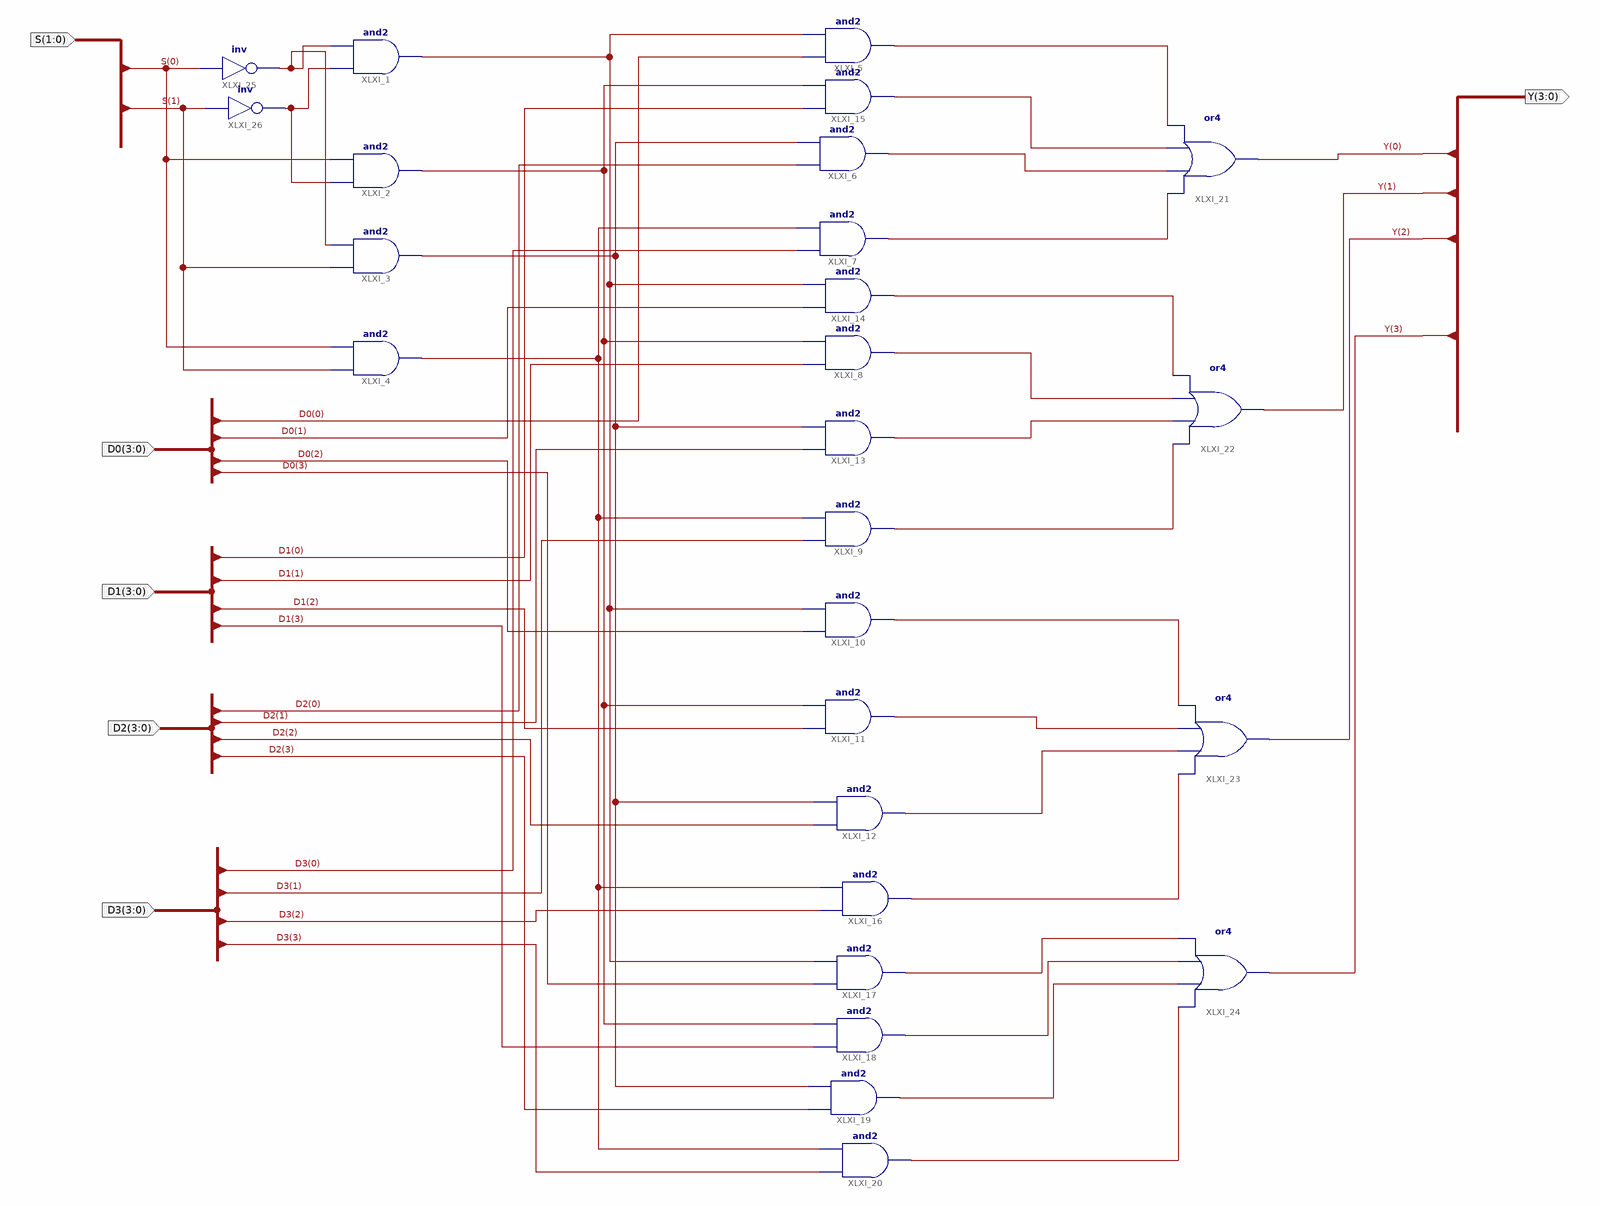
[diagram p0: schematic sheet 1]
// Xilinx ISE schematic Mux4to1b4.sch (kintex7) as structural Verilog: 26 symbols, 6 ports
module Mux4to1b4 (
  input  [1:0] S,
  input  [3:0] D0,
  input  [3:0] D1,
  input  [3:0] D2,
  input  [3:0] D3,
  output [3:0] Y
);

  wire XLXN_6, XLXN_14, XLXN_24, XLXN_32, XLXN_36, XLXN_40, XLXN_63, XLXN_64, XLXN_65, XLXN_66, XLXN_67,
       XLXN_68, XLXN_69, XLXN_70, XLXN_71, XLXN_72, XLXN_73, XLXN_74, XLXN_75, XLXN_76, XLXN_77, XLXN_78;

  and XLXI_1 (XLXN_24, XLXN_14, XLXN_6);
  and XLXI_2 (XLXN_32, XLXN_14, S[0]);
  and XLXI_3 (XLXN_36, S[1], XLXN_6);
  and XLXI_4 (XLXN_40, S[1], S[0]);
  and XLXI_5 (XLXN_63, D0[0], XLXN_24);
  and XLXI_6 (XLXN_65, D2[0], XLXN_36);
  and XLXI_7 (XLXN_66, D3[0], XLXN_40);
  and XLXI_8 (XLXN_68, D1[1], XLXN_32);
  and XLXI_9 (XLXN_70, D3[1], XLXN_40);
  and XLXI_10 (XLXN_71, D0[2], XLXN_24);
  and XLXI_11 (XLXN_72, D1[2], XLXN_32);
  and XLXI_12 (XLXN_73, D2[2], XLXN_36);
  and XLXI_13 (XLXN_69, D2[1], XLXN_36);
  and XLXI_14 (XLXN_67, D0[1], XLXN_24);
  and XLXI_15 (XLXN_64, D1[0], XLXN_32);
  and XLXI_16 (XLXN_74, D3[2], XLXN_40);
  and XLXI_17 (XLXN_75, D0[3], XLXN_24);
  and XLXI_18 (XLXN_76, D1[3], XLXN_32);
  and XLXI_19 (XLXN_77, D2[3], XLXN_36);
  and XLXI_20 (XLXN_78, D3[3], XLXN_40);
  or XLXI_21 (Y[0], XLXN_66, XLXN_65, XLXN_64, XLXN_63);
  or XLXI_22 (Y[1], XLXN_70, XLXN_69, XLXN_68, XLXN_67);
  or XLXI_23 (Y[2], XLXN_74, XLXN_73, XLXN_72, XLXN_71);
  or XLXI_24 (Y[3], XLXN_78, XLXN_77, XLXN_76, XLXN_75);
  not XLXI_25 (XLXN_6, S[0]);
  not XLXI_26 (XLXN_14, S[1]);
endmodule
